# Altium schematic sheet BDC_SM.SchDoc
size A
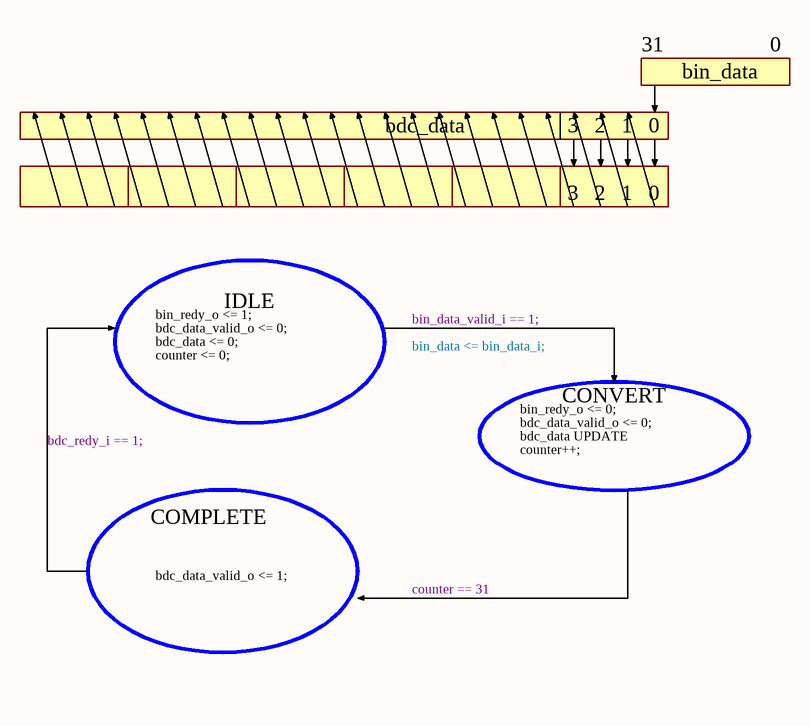
[diagram p0: BDC_SM.SchDoc]

## Notes on the sheet
- 31
- bin_data
- 0
- bdc_data
- 3
- 2
- 1
- bin_redy_o <= 1;
- bdc_data_valid_o <= 0;
- bdc_data <= 0;
- IDLE
- bin_data_valid_i == 1;
- counter <= 0;
- bin_data <= bin_data_i;
- bin_redy_o <= 0;
- CONVERT
- bdc_redy_i == 1;
- bdc_data UPDATE
- counter++;
- COMPLETE
- bdc_data_valid_o <= 1;
- counter == 31